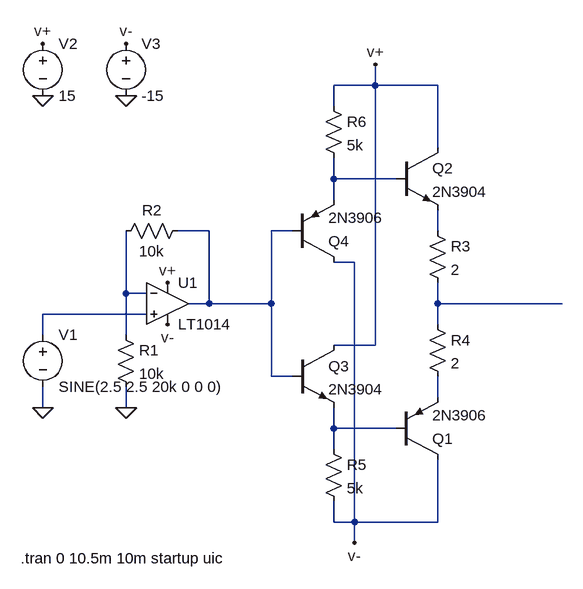
[diagram p0: schematic Gate Buffer.asc]
Gate Buffer.asc, the LTspice schematic file:
Version 4
SHEET 1 880 680
WIRE 496 -160 496 -192
WIRE 496 -160 432 -160
WIRE 592 -160 496 -160
WIRE 432 -128 432 -160
WIRE 592 -64 592 -160
WIRE 432 -16 432 -48
WIRE 528 -16 432 -16
WIRE 432 16 432 -16
WIRE 240 64 192 64
WIRE 368 64 336 64
WIRE 592 64 592 32
WIRE 464 112 432 112
WIRE 112 160 112 64
WIRE 144 160 112 160
WIRE 240 176 240 64
WIRE 240 176 208 176
WIRE 336 176 336 64
WIRE 336 176 240 176
WIRE 592 176 592 144
WIRE 784 176 592 176
WIRE 144 192 -16 192
WIRE 592 208 592 176
WIRE -16 224 -16 192
WIRE 112 224 112 160
WIRE 496 240 496 -160
WIRE 496 240 432 240
WIRE 336 288 336 176
WIRE 368 288 336 288
WIRE 592 320 592 288
WIRE -16 336 -16 304
WIRE 112 336 112 304
WIRE 432 368 432 336
WIRE 528 368 432 368
WIRE 432 400 432 368
WIRE 432 512 432 480
WIRE 464 512 464 112
WIRE 464 512 432 512
WIRE 592 512 592 416
WIRE 592 512 464 512
WIRE 464 544 464 512
FLAG 112 336 0
FLAG -16 336 0
FLAG -16 -144 0
FLAG 112 -144 0
FLAG -16 -224 v+
FLAG 112 -224 v-
FLAG 176 208 v-
FLAG 176 144 v+
FLAG 496 -192 v+
FLAG 464 544 v-
SYMBOL Opamps\\LT1014 176 112 R0
SYMATTR InstName U1
SYMBOL res 96 208 R0
SYMATTR InstName R1
SYMATTR Value 10k
SYMBOL res 208 48 R90
WINDOW 0 0 56 VBottom 2
WINDOW 3 32 56 VTop 2
SYMATTR InstName R2
SYMATTR Value 10k
SYMBOL voltage -16 208 R0
WINDOW 123 0 0 Left 0
WINDOW 39 0 0 Left 0
SYMATTR InstName V1
SYMATTR Value SINE(2.5 2.5 20k 0 0 0)
SYMBOL voltage -16 -240 R0
WINDOW 123 0 0 Left 0
WINDOW 39 0 0 Left 0
SYMATTR InstName V2
SYMATTR Value 15
SYMBOL voltage 112 -240 R0
WINDOW 123 0 0 Left 0
WINDOW 39 0 0 Left 0
SYMATTR InstName V3
SYMATTR Value -15
SYMBOL res 576 48 R0
SYMATTR InstName R3
SYMATTR Value 2
SYMBOL res 576 192 R0
SYMATTR InstName R4
SYMATTR Value 2
SYMBOL pnp 528 416 M180
SYMATTR InstName Q1
SYMATTR Value 2N3906
SYMBOL npn 528 -64 R0
SYMATTR InstName Q2
SYMATTR Value 2N3904
SYMBOL res 416 384 R0
SYMATTR InstName R5
SYMATTR Value 5k
SYMBOL res 416 -144 R0
SYMATTR InstName R6
SYMATTR Value 5k
SYMBOL npn 368 240 R0
SYMATTR InstName Q3
SYMATTR Value 2N3904
SYMBOL pnp 368 112 M180
SYMATTR InstName Q4
SYMATTR Value 2N3906
TEXT -50 568 Left 2 !.tran 0 10.5m 10m startup uic

The netlist it stands for:
* Gate Buffer.asc
XU1 N006 N004 v+ v- N002 LT1014  ; pins In+ In- V+ V- OUT
R1 N004 0 10k
R2 N002 N004 10k
V1 N006 0 SINE(2.5 2.5 20k 0 0 0)
V2 v+ 0 15
V3 v- 0 -15
R3 N003 N005 2
R4 N005 N007 2
Q1 v- N008 N007 0 2N3906
Q2 v+ N001 N003 0 2N3904
R5 N008 v- 5k
R6 v+ N001 5k
Q3 v+ N002 N008 0 2N3904
Q4 v- N002 N001 0 2N3906
.model NPN NPN
.model PNP PNP
.lib standard.bjt
.tran 0 10.5m 10m startup uic
.backanno
.end